# EAGLE design M8-Relay-Quad (EAGLE 9.6.2)
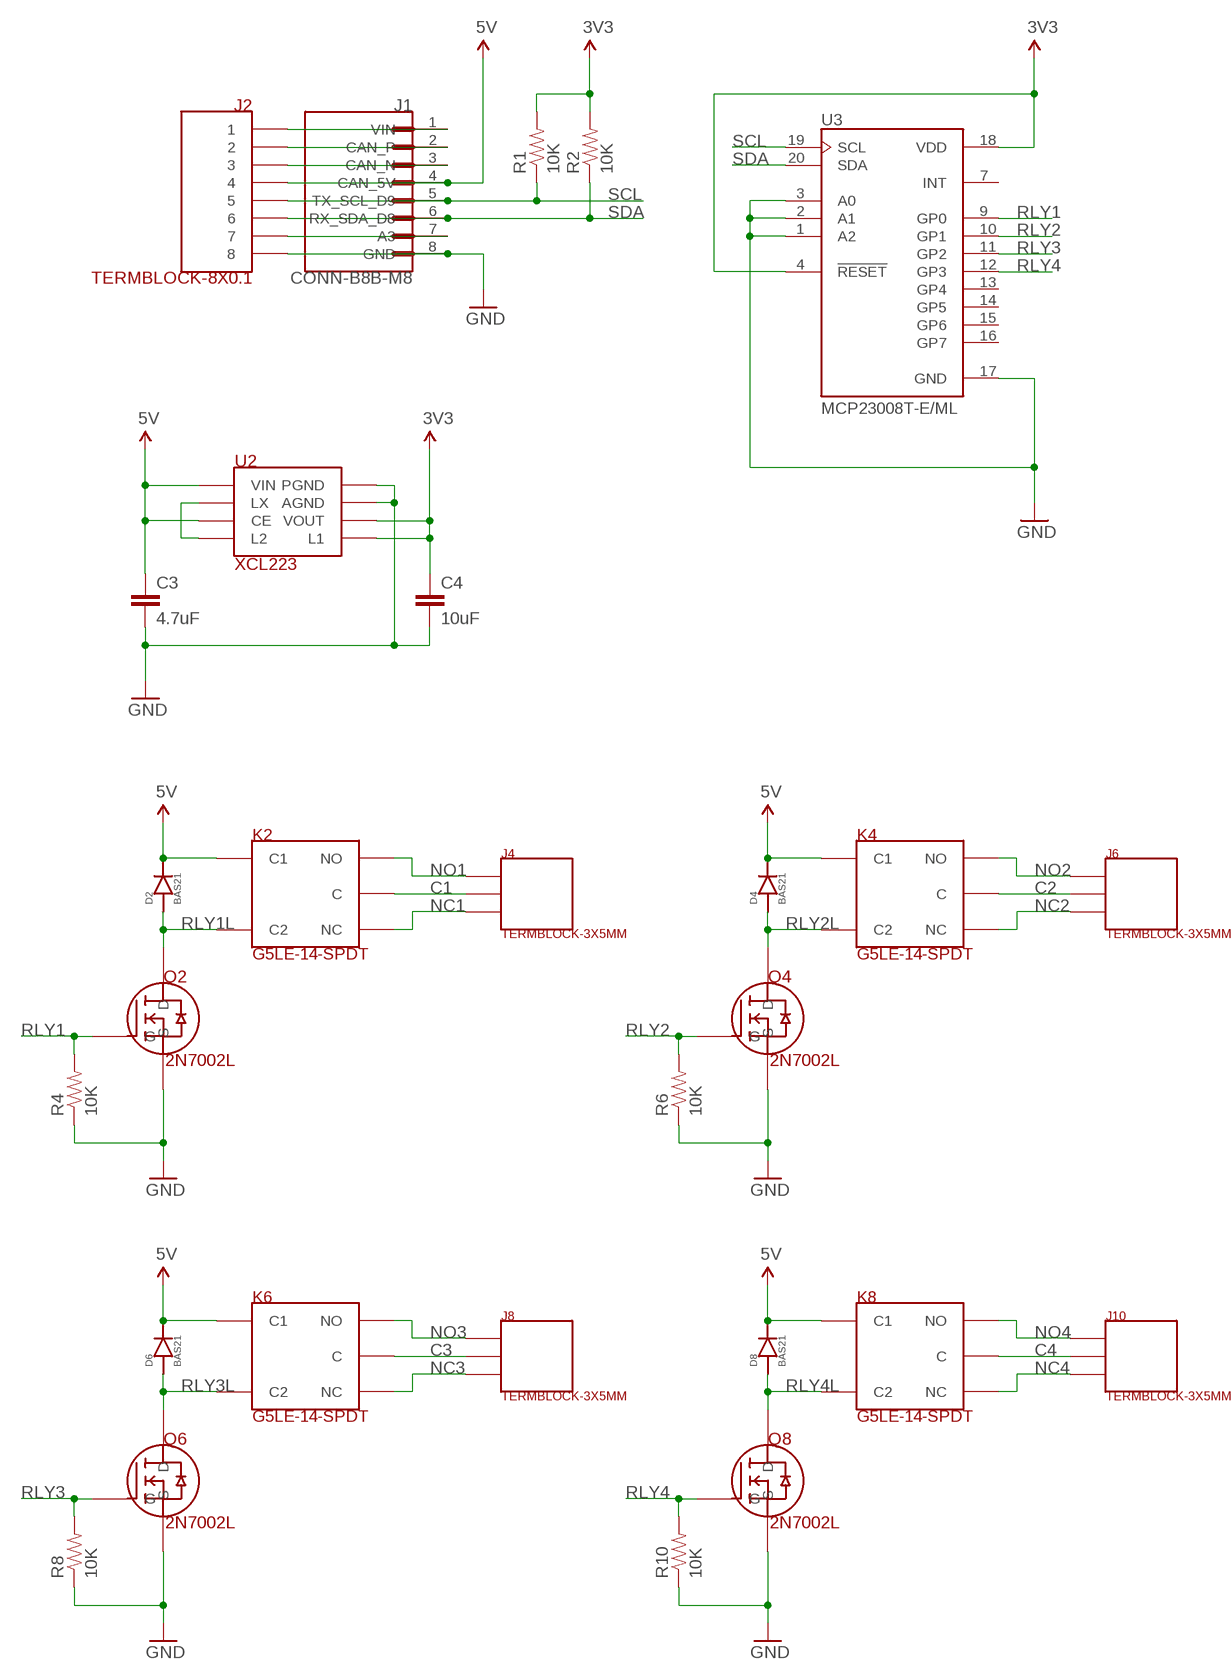
[diagram p0: schematic, sheet 1]

## Parts
C3  4.7uF  CAP-4.7UF-0603  [0603-CAP]
C4  10uF  CAP-10UF-0603  [0603-CAP]
D2  BAS21  DIODE-BAS21  [DIODE-BAS21]
D4  BAS21  DIODE-BAS21  [DIODE-BAS21]
D6  BAS21  DIODE-BAS21  [DIODE-BAS21]
D8  BAS21  DIODE-BAS21  [DIODE-BAS21]
J1  CONN-B8B-M8  [JST_B8B-PH-SM4-TB(LF)(SN)]
J2  TERMBLOCK-8X0.1  [TERMBLOCK-8X0.1]
J4  TERMBLOCK-3X5MM  [TERMBLOCK-3X5MM]
J6  TERMBLOCK-3X5MM  [TERMBLOCK-3X5MM]
J8  TERMBLOCK-3X5MM  [TERMBLOCK-3X5MM]
J10  TERMBLOCK-3X5MM  [TERMBLOCK-3X5MM]
K2  G5LE-14-SPDT  RELAY-G5LE-14-SPDT  [RELAY-G5LE-14-SPDT]
K4  G5LE-14-SPDT  RELAY-G5LE-14-SPDT  [RELAY-G5LE-14-SPDT]
K6  G5LE-14-SPDT  RELAY-G5LE-14-SPDT  [RELAY-G5LE-14-SPDT]
K8  G5LE-14-SPDT  RELAY-G5LE-14-SPDT  [RELAY-G5LE-14-SPDT]
Q2  2N7002L  [2N7002L]
Q4  2N7002L  [2N7002L]
Q6  2N7002L  [2N7002L]
Q8  2N7002L  [2N7002L]
R1  10K  RES-10K-06030603  [0603-RES]
R2  10K  RES-10K-06030603  [0603-RES]
R4  10K  RES-10K-06030603  [0603-RES]
R6  10K  RES-10K-06030603  [0603-RES]
R8  10K  RES-10K-06030603  [0603-RES]
R10  10K  RES-10K-06030603  [0603-RES]
U2  XCL223  REG-XCL223  [REG-XCL223-LESS-CREAM]
U3  MCP23008T-E/ML  [QFN21P50_400X400X100L40X24T270N]

## Nets
3V3: C4.1 R1.2 R2.2 U2.3(VOUT) U2.7(L1) U3.4(!RESET) U3.18(VDD)
5V: C3.1 D2.3(CATHODE) D4.3(CATHODE) D6.3(CATHODE) D8.3(CATHODE) J1.4(CAN_5V) J2.P$4 K2.2(C1) K4.2(C1) K6.2(C1) K8.2(C1) U2.4(CE) U2.6(VIN)
A3: J1.7(A3) J2.P$7
C1: J4.2 K2.1(C)
C2: J6.2 K4.1(C)
C3: J8.2 K6.1(C)
C4: J10.2 K8.1(C)
CAN_N: J1.3(CAN_N) J2.P$3
CAN_P: J1.2(CAN_P) J2.P$2
GND: C3.2 C4.2 J1.8(GND) J2.P$8 Q2.2(S) Q4.2(S) Q6.2(S) Q8.2(S) R4.1 R6.1 R8.1 R10.1 U2.1(PGND) U2.2(AGND) U3.1(A2) U3.2(A1) U3.3(A0) U3.17(GND)
LX: U2.5(LX) U2.8(L2)
NC1: J4.3 K2.4(NC)
NC2: J6.3 K4.4(NC)
NC3: J8.3 K6.4(NC)
NC4: J10.3 K8.4(NC)
NO1: J4.1 K2.3(NO)
NO2: J6.1 K4.3(NO)
NO3: J8.1 K6.3(NO)
NO4: J10.1 K8.3(NO)
RLY1: Q2.1(G) R4.2 U3.9(GP0)
RLY1L: D2.1(ANODE) K2.5(C2) Q2.3(D)
RLY2: Q4.1(G) R6.2 U3.10(GP1)
RLY2L: D4.1(ANODE) K4.5(C2) Q4.3(D)
RLY3: Q6.1(G) R8.2 U3.11(GP2)
RLY3L: D6.1(ANODE) K6.5(C2) Q6.3(D)
RLY4: Q8.1(G) R10.2 U3.12(GP3)
RLY4L: D8.1(ANODE) K8.5(C2) Q8.3(D)
SCL: J1.5(TX_SCL_D9) J2.P$5 R1.1 U3.19(SCL)
SDA: J1.6(RX_SDA_D8) J2.P$6 R2.1 U3.20(SDA)
VIN: J1.1(VIN) J2.P$1
Unconnected: U3.7(INT) U3.13(GP4) U3.14(GP5) U3.15(GP6) U3.16(GP7)

## Library data of the parts
C3 = rickk2:CAP-4.7UF-0603: Murata X5R series CAP CER 4.7UF 6.3V X5R 0603 $0.12 https://www.digikey.com/product-detail/en/murata-electronics-north-america/GRM188R60J475KE19J/490-6407-1-ND/3845604
C4 = rickk2:CAP-10UF-0603: CAP CER 10UF 16V X5R 0805 $ 0.21 https://www.digikey.com/product-detail/en/murata-electronics-north-america/GRM21BR61C106KE15L/490-3886-1-ND/965928
D2 D4 D6 D8 = rickk2:DIODE-BAS21: Diodes Incorporated BAS21-7-F $ 0.14 http://www.digikey.com/product-detail/en/BAS21-7-F/BAS21-FDICT-ND/717813 Surface mount SOT-23-3
J1 = rickk2:CONN-B8B-M8: PH Series 2 mm Pitch 12 Position SMT Single Row Top Entry Shrouded Header
J2 = rickk2:TERMBLOCK-8X0.1: Term Block 8x0.1" 20-30AWG 6A 125V Max Side Entry On Shore Technology Inc. OSTVN08A150 TERM BLK 8P SIDE ENT 2.54MM PCB 8 Position Wire to Board Terminal Block Horizontal with Board 0.100" (2.54mm) Through Hole https://www.digikey.com/product-detail/en/on-shore-technology-inc/OSTVN08A150/ED10566-ND/1588868
J4 J6 J8 J10 = rickk2:TERMBLOCK-3X5MM: TERM BLK 3POS SIDE ENTRY 5MM PCB On Shore Technology Inc. ED700/3 $1.84 3 Position Wire to Board Terminal Block Horizontal with Board 0.197" (5.00mm) Through Hole https://www.digikey.com/product-detail/en/on-shore-technology-inc/ED700-3/ED1632-ND/33961 - 20A 300V - 12-30 AWG - Not ordered yet
K2 K4 K6 K8 = rickk2:RELAY-G5LE-14-SPDT: RELAY GEN PURPOSE SPDT 10A 5V Omron Electronics Inc-EMC Div G5LE-14 DC5 General Purpose Relay SPDT (1 Form C) 5VDC Coil Through Hole https://www.digikey.com/product-detail/en/omron-electronics-inc-emc-div/G5LE-14-DC5/Z1011-ND/280371 - 250VAC, 125VDC - Max - 79.4 mA coil current, non-latching - Operate: 10 ms, Release: 5 ms - Order 10 - not ordered yet
Q2 Q4 Q6 Q8 = rickk2:2N7002L: MOSFET N-CH 60V 0.115A SOT-23 $ 0.16 On Semicondutor 2N7002LT1G N-Channel 115mA (Tc) 225mW (Ta) Surface Mount SOT-23-3 (TO-236) https://www.digikey.com/product-detail/en/on-semiconductor/2N7002LT3G/2N7002LT3GOSCT-ND/2704932 1=G, high=D is connected to S (GND), the "on" state 2=S to GND (bottom of symbol) 3=D to load (top of symbol, pin on the side by itself) 2A version: Diodes Inc DMN6075S-7 MOSFET N-CH 60V 2A SOT23-3 $0.45 https://www.digikey.com/product-detail/en/diodes-incorporated/DMN6075S-7/DMN6075S-7DICT-ND/5149299 Old: https://www.digikey.com/product-detail/en/on-semiconductor/2N7002LT1G/2N7002LT1GOSCT-ND/917791
R1 R2 R4 R6 R8 R10 = rickk2:RES-10K-0603: RES SMD 10K OHM 5% 1/4W 0603 $ 0.10 https://www.digikey.com/product-detail/en/panasonic-electronic-components/ERJ-PA3J103V/P10KBZCT-ND/5036237
U2 = rickk2:REG-XCL223: Manufacturer: Torex Semiconductor Ltd Manufacturer Part Number: XCL223A333D2-G DC DC CONVERTER 3.3V Detailed Description: Non-Isolated PoL Modul $2.63 https://www.digikey.com/product-detail/en/torex-semiconductor-ltd/XCL223A333D2-G/893-1416-1-ND/8256118 CIN=4.7uF 10V CL = 10uF 10V VIN MAX=5.5V VOUT=3.3V
U3 = rickk2:MCP23008T-E/ML: Not purchased yet Microchip Technology MCP23008T-E/ML $1.10 I/O Expander 8 I²C 1.7MHz 20-QFN-EP (4x4) https://www.digikey.com/product-detail/en/microchip-technology/MCP23008T-E-ML/MCP23008T-E-MLCT-ND/7916525 MCP23008 Series 5.5 V 1.7 MHz 8-Bit I/O Expander with Serial Interface - QFN-20; ARROW_ELECTRONICS-PURCHASE-URL: https://snapeda.com/shop?store=Arrow+Electronics&id=4816241; DESCRIPTION: IC I/O EXPANDER I2C 8B 20QFN; DIGIKEY-PURCHASE-URL: https://snapeda.com/shop?store=DigiKey&id=4816241; MF: Microchip Technology; MOUSER-PURCHASE-URL: https://snapeda.com/shop?store=Mouser&id=4816241; MP: MCP23008T-E/ML; PACKAGE: None

## Board
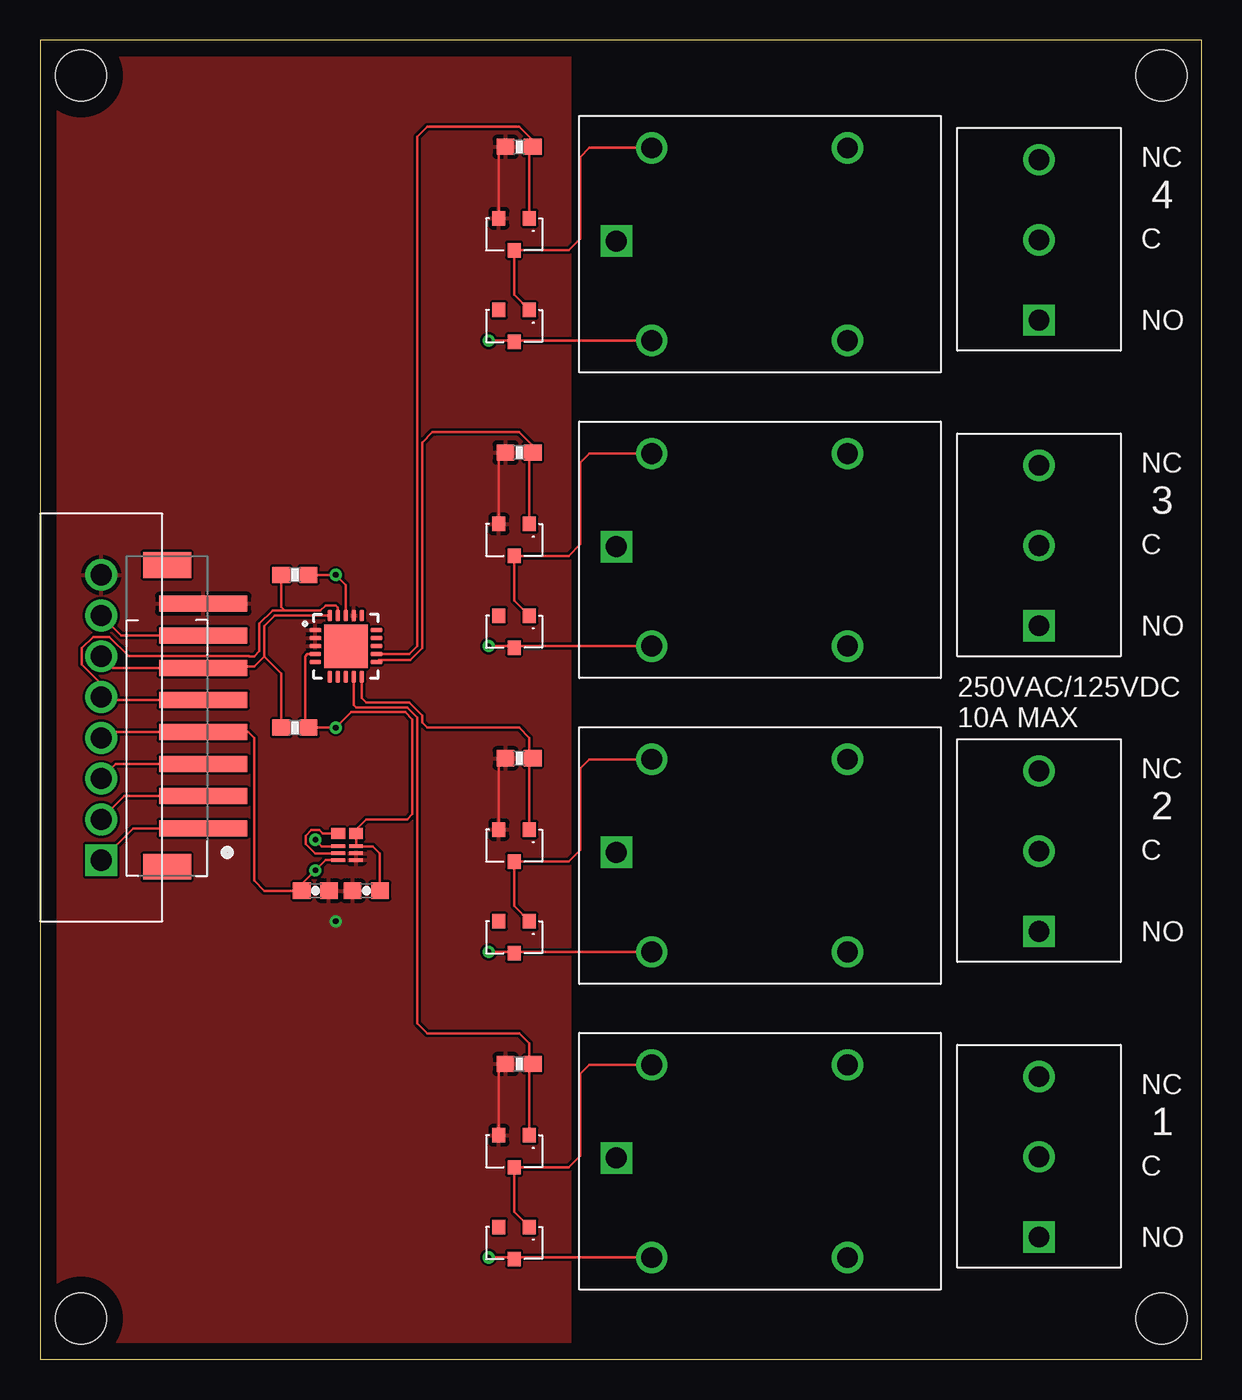
[diagram p1: board, top side]
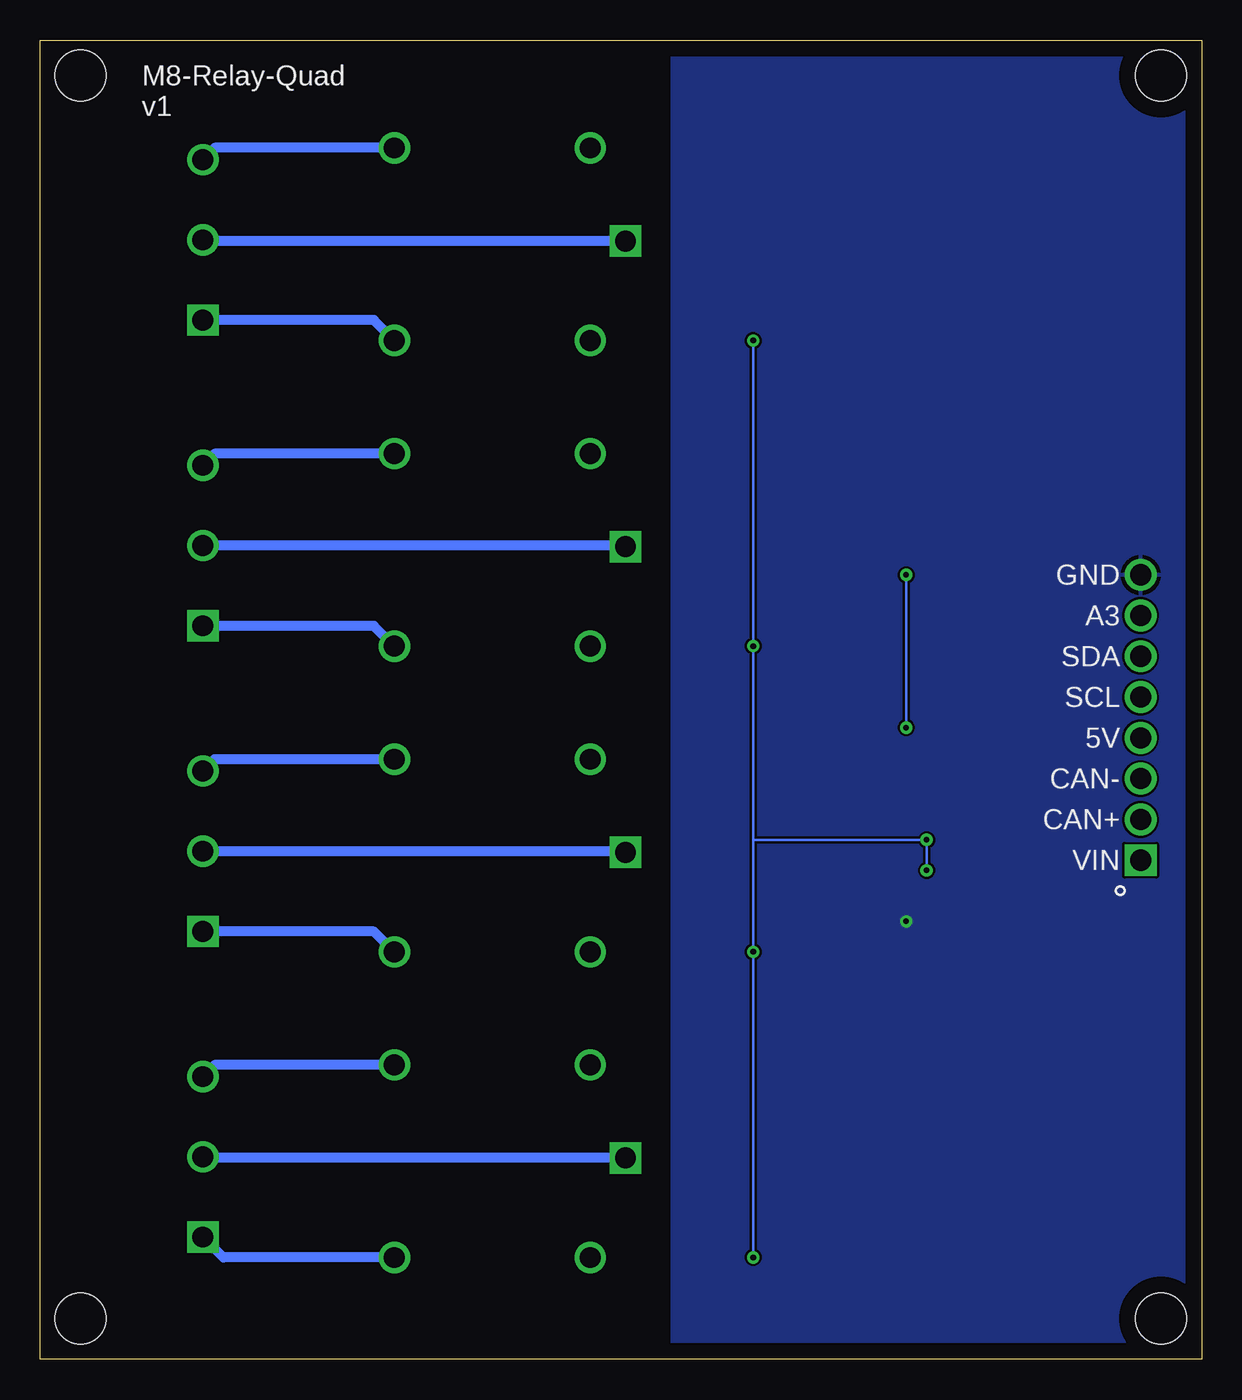
[diagram p2: board, bottom side, seen from below]

Size 72.37 x 82.22 mm. Coordinates in mm from the lower left corner, seen from the top.
Outline: 0,0 72.37,0 72.37,82.22 0,82.22 0,0
Copper layers (1*16): Top 0.035mm / dielectric 1.5mm / Bottom 0.035mm
Design rules "default": minimum track width 6mil, minimum drill 0.35mm, track to track 6mil, track to pad 6mil, pad to pad 6mil, via to via 6mil, smd to smd 6mil, copper to edge 40mil, drill to drill 6mil, minimum pad ring 10mil, minimum via ring 8mil, stop-mask expansion 4mil, vias tented up to drill 0mil, thermal gap 10mil
Holes 3.17 mm at 69.85,2.54 69.85,80.01 2.54,80.01 2.54,2.54

### Footprints (pad centres in the part's own frame; a part is rotated, then mirrored left to right if it is on the bottom)
0603-CAP = smd 1.1 x 1: 1 -0.85,0; 2 0.85,0
DIODE-BAS21 = smd 0.8 x 0.9: 1 0,0; 2 1.9,0; 3 0.95,2
JST_B8B-PH-SM4-TB(LF)(SN) = smd 1 x 5.5: 1 -5,0; 2 -3,0; 3 -1,0; 4 1,0; 5 3,0; 6 5,0; 7 7,0; 8 9,0 | smd 1.6 x 3: P1 -7.4,2.25; P2 11.4,2.25
TERMBLOCK-8X0.1 = drill 1.321 square: P$1 -8.89,0 | drill 1.321: P$2 -6.35,0; P$3 -3.81,0; P$4 -1.27,0; P$5 1.27,0; P$6 3.81,0; P$7 6.35,0; P$8 8.89,0
TERMBLOCK-3X5MM = drill 1.3 square: 1 0,0 | drill 1.3: 2 5,0; 3 10,0
RELAY-G5LE-14-SPDT = drill 1.3 square: 1 -2.2,6.2 | drill 1.3: 2 0,0; 3 12.2,0; 4 12.2,12; 5 0,12
2N7002L = smd 0.8 x 0.9: 1 0,0; 2 1.9,0; 3 0.95,2
0603-RES = smd 1.1 x 1: 1 -0.85,0; 2 0.85,0
REG-XCL223-LESS-CREAM = smd 0.85 x 0.21: 1 0,0; 2 0,0.43; 3 0,0.86; 4 -1.11,0.86; 5 -1.11,0.43; 6 -1.11,0 | smd 0.85 x 0.7: 7 0,1.655; 8 -1.11,1.655
QFN21P50_400X400X100L40X24T270N = smd 0.71 x 0.26: 1 -1.905,1; 2 -1.905,0.5; 3 -1.905,0; 4 -1.905,-0.5; 5 -1.905,-1; 11 1.905,-1; 12 1.905,-0.5; 13 1.905,0; 14 1.905,0.5; 15 1.905,1 | smd 0.26 x 0.71: 6 -1,-1.905; 7 -0.5,-1.905; 8 0,-1.905; 9 0.5,-1.905; 10 1,-1.905; 16 1,1.905; 17 0.5,1.905; 18 0,1.905; 19 -0.5,1.905; 20 -1,1.905 | smd 2.7 x 2.7: 21 0,0

### Placement (x,y rotation side)
C3  17.14,29.21 0 top
C4  20.32,29.21 180 top
D2  30.48,8.26 180 top
D4  30.48,27.3 180 top
D6  30.48,46.35 180 top
D8  30.48,65.41 180 top
J1  10.16,38.1 90 top
J2  3.81,40.01 90 top
J4  62.23,7.62 90 top
J6  62.23,26.67 90 top
J8  62.23,45.72 90 top
J10  62.23,64.77 90 top
K2  38.1,6.35 0 top
K4  38.1,25.4 0 top
K6  38.1,44.45 0 top
K8  38.1,63.5 0 top
Q2  30.48,13.97 180 top
Q4  30.48,33.02 180 top
Q6  30.48,52.07 180 top
Q8  30.48,71.12 180 top
R1  15.88,48.9 0 top
R2  15.88,39.37 0 top
R4  29.84,18.41 0 top
R6  29.84,37.47 0 top
R8  29.84,56.52 0 top
R10  29.84,75.56 0 top
U2  19.68,31.11 0 top
U3  19.05,44.45 0 top

### Tracks (layer width: path | path; a pad name or v marks a point on that pad's centre or on a via)
3V3  (via drill 0.35)
  Top 0.152: C4.1 21.17,31.54 20.73,31.98 U2.3 U2.7 19.68,33.02 20.32,33.66 22.86,33.66 23.19,33.98 23.19,39.88 22.73,40.34 19.38,40.34 v18.41,39.37 R2.2 16.51,39.59 16.51,43.81 16.64,43.95 U3.4 | R1.2 v18.41,48.9 19.05,48.26 U3.18
  Bottom 0.152: v18.41,48.9 v18.41,39.37
5V  (via drill 0.35)
  Top 0.152: U2.4 17.55,31.98 v17.14,32.38 | U2.6 17.78,31.11 v17.14,30.48 16.3,29.63 C3.1 13.97,29.21 13.34,29.84 13.34,38.73 12.97,39.1 J1.4 4.17,39.1 J2.P$4 | K2.2 29.62,6.35 D2.3 29.43,6.35 v27.94,6.35 | K4.2 29.62,25.4 D4.3 29.43,25.4 v27.94,25.4 | D6.3 29.62,44.45 | 29.62,44.45 K6.2 | K8.2 29.62,63.5 D8.3 29.43,63.5 v27.94,63.5 | v27.94,44.45 29.62,44.45
  Bottom 0.152: v17.14,30.48 v17.14,32.38 27.94,32.38 | v27.94,63.5 v27.94,44.45 27.94,32.38 | 27.94,32.38 v27.94,25.4 v27.94,6.35
A3
  Top 0.152: J1.7 5.07,45.1 J2.P$7
C1
  Bottom 0.61: K2.1 62.16,12.55 J4.2
C2
  Bottom 0.61: K4.1 35.97,31.67 J6.2
C3
  Bottom 0.61: K6.1 35.97,50.72 J8.2
C4
  Bottom 0.61: K8.1 62.16,69.7 J10.2
CAN_N
  Top 0.152: J1.3 4.71,37.1 J2.P$3
CAN_P
  Top 0.152: J1.2 5.25,35.1 J2.P$2
GND  (via drill 0.35)
  Top 0.152: Q2.2 28.58,18 R4.1 | Q4.2 28.58,37.05 R6.1 | Q6.2 28.58,56.1 R8.1 | Q8.2 28.58,75.15 R10.1
  other vias: 18.41,27.3
  pour Top: 0,0 0,85.09 33.02,85.09 33.02,0
  pour Bottom: 0,0 0,86.36 1.27,86.36 33.02,86.36 33.02,0
LX
  Top 0.152: U2.8 17.62,32.77 17.4,32.99 16.89,32.99 16.54,32.64 16.54,32.13 17.13,31.55 U2.5
NC1
  Bottom 0.61: K2.4 61.5,18.35 J4.3
NC2
  Bottom 0.61: K4.4 61.5,37.4 J6.3
NC3
  Bottom 0.61: K6.4 61.5,56.45 J8.3
NC4
  Bottom 0.61: K8.4 61.5,75.5 J10.3
NO1
  Bottom 0.61: K2.3 60.96,6.35 J4.1
NO2
  Bottom 0.61: K4.3 51.57,26.67 J6.1
NO3
  Bottom 0.61: K6.3 51.57,45.72 J8.1
NO4
  Bottom 0.61: K8.3 51.57,64.77 J10.1
RLY1
  Top 0.152: Q2.1 30.48,18.2 R4.2 30.48,18.63 30.48,19.68 29.84,20.32 24.13,20.32 23.5,20.95 23.5,40.01 22.86,40.64 19.68,40.64 19.55,40.77 U3.9
RLY1L
  Top 0.152: D2.1 29.53,9.21 Q2.3 32.92,11.97 33.66,12.7 33.66,17.78 34.23,18.35 K2.5
RLY2
  Top 0.152: Q4.1 30.48,37.25 R6.2 30.48,37.68 30.48,38.73 29.84,39.37 24.13,39.37 23.8,39.7 23.8,40.13 22.99,40.95 20.32,40.95 20.05,41.22 U3.10
RLY2L
  Top 0.152: D4.1 29.53,28.25 Q4.3 32.92,31.02 33.66,31.75 33.66,36.83 34.23,37.4 K4.5
RLY3
  Top 0.152: Q6.1 30.48,56.3 R8.2 30.7,56.94 29.84,57.78 24.43,57.78 23.8,57.15 23.8,44.32 23.07,43.59 21.1,43.59 U3.11
RLY3L
  Top 0.152: D6.1 29.53,47.3 Q6.3 32.92,50.07 33.66,50.8 33.66,55.88 34.23,56.45 K6.5
RLY4
  Top 0.152: Q8.1 30.48,75.35 R10.2 30.7,75.98 29.84,76.83 24.13,76.83 23.5,76.2 23.5,44.45 23,43.95 U3.12
RLY4L
  Top 0.152: D8.1 29.53,66.36 Q8.3 32.92,69.12 33.66,69.85 33.66,74.93 34.23,75.5 K8.5
SCL
  Top 0.152: J1.5 3.98,41.1 J2.P$5 3.81,42.09 2.59,43.31 2.59,44.32 3.31,45.03 4.32,45.03 5.52,43.83 13.01,43.83 13.02,43.81 13.34,43.81 13.66,44.15 13.66,45.85 14.48,46.66 15.24,46.66 | 15.24,46.66 17.45,46.66 17.78,46.99 18.41,46.99 18.55,46.85 U3.19 | R1.1 15.03,46.88 15.24,46.66
SDA
  Top 0.152: J2.P$6 4.53,43.1 J1.6 10.24,43.18 13.34,43.18 13.97,43.81 | 13.97,43.81 13.97,45.72 14.61,46.35 U3.20 | R2.1 15.03,42.76 13.97,43.81
VIN
  Top 0.152: J2.P$1 5.79,33.1 J1.1

### Text on the board
tPlace: NC | 4 | C | NO | NC | 3 | C | NO | 250VAC/125VDC / 10A MAX | NC | 2 | C | NO | NC | 1 | C | NO
bPlace: M8-Relay-Quad / v1 | GND | A3 | SDA | SCL | 5V | CAN- | CAN+ | VIN